# EAGLE schematic MEGA328 (EAGLE 9.6.2)
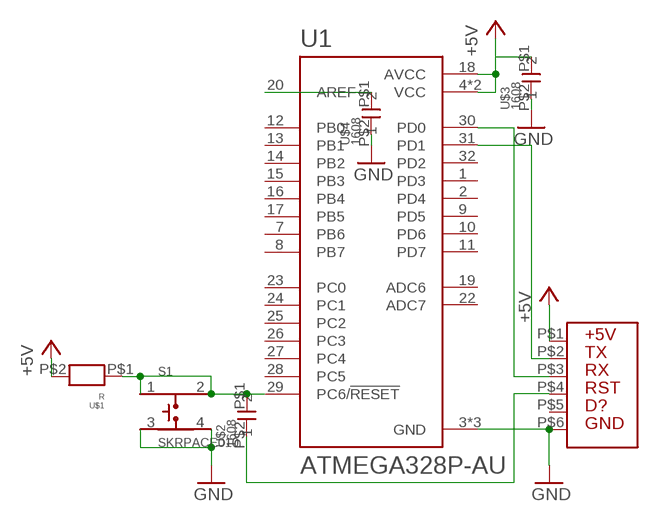
[diagram p0: schematic, sheet 1]

## Parts
S1  SKRPACE010  [SW_SKRPACE010]
U1  ATMEGA328P-AU  [QFP80P900X900X120-32N]
U$1  R  [1608]
U$2  1608  [CON]
U$3  1608  [CON]
U$4  1608  [CON]
U$5  SI  [SI]

## Nets
+5V: U1.4(VCC) U1.6(VCC) U1.18(AVCC) U$1.P$2 U$3.P$1 U$5.P$1
GND: S1.3 S1.4 U1.3(GND) U1.5(GND) U1.21(GND) U$3.P$2 U$4.P$2 U$5.P$6
N$2: U1.20(AREF) U$4.P$1
N$3: S1.1 S1.2 U1.29(PC6/!RESET) U$1.P$1 U$2.P$1
N$5: U$2.P$2 U$5.P$4
N$6: U1.31(PD1) U$5.P$2
N$7: U1.30(PD0) U$5.P$3
Unconnected: U1.1(PD3) U1.2(PD4) U1.7(PB6) U1.8(PB7) U1.9(PD5) U1.10(PD6) U1.11(PD7) U1.12(PB0) U1.13(PB1) U1.14(PB2) U1.15(PB3) U1.16(PB4) U1.17(PB5) U1.19(ADC6) U1.22(ADC7) U1.23(PC0) U1.24(PC1) U1.25(PC2) U1.26(PC3) U1.27(PC4) U1.28(PC5) U1.32(PD2) U$5.P$5

## Library data of the parts
S1 = SKRPACE010:SKRPACE010: Switch Tactile N.O. SPST Button J-Bend 0.05A 16VDC 2.55N SMD Automotive T/R Check prices <https://pricing.snapeda.com/parts/SKRPACE010/ALPS/view-part?ref=eda>; AVAILABILITY: In Stock; DESCRIPTION: Switch Tactile N.O. SPST Button J-Bend 0.05A 16VDC 2.55N SMD Automotive T/R; MF: ALPS; MP: SKRPACE010; PACKAGE: None; PRICE: None
U1 = ATMEGA328P-AU:ATMEGA328P-AU: ATmega Series 20 MHz 32 KB Flash 2 KB SRAM 8-Bit Microcontroller - TQFP-32 Check prices <https://pricing.snapeda.com/parts/ATMEGA328P-AU/Microchip%20Technology/view-part?ref=eda>; AVAILABILITY: In Stock; DESCRIPTION: AVR AVR® ATmega Microcontroller IC 8-Bit 20MHz 32KB (16K x 16) FLASH 32-TQFP (7x7); MF: Microchip Technology; MP: ATMEGA328P-AU; PACKAGE: TQFP-32 Microchip; PRICE: None
U$1 = R 1608:R
U$2-U$4 = con1608:1608
U$5 = プログラム入力:SI